# Altium schematic sheet PSU.SchDoc
size A
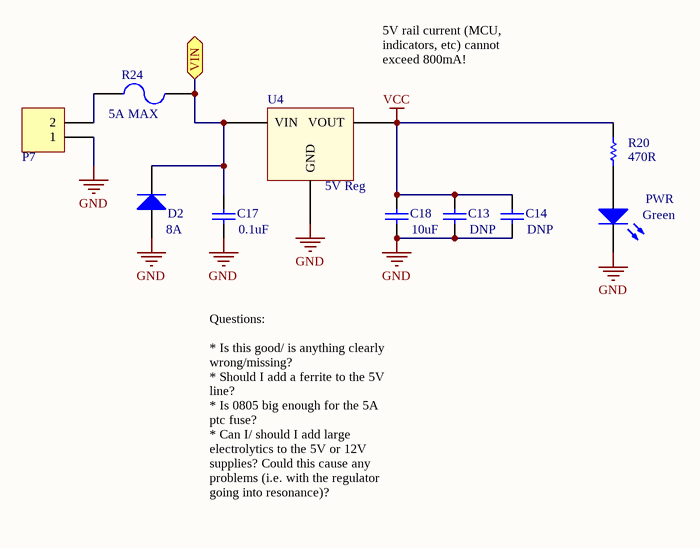
[diagram p0: PSU.SchDoc]

## Parts
C13  value DNP  [0805]  (hidden comment: Cap)
C14  value DNP  [0805]  (hidden comment: Cap)
C17  value 0.1uF  [0805]  (hidden comment: Cap)
C18  value 10uF  [0805]  (hidden comment: Cap)
D2  Max Current: 8A  [S8MC Diode]  (hidden comment: Diode S8MC)
P7  Screw Terminal  [Screw Terminal]  (value not drawn)
PWR  Color: Green  [0805]  (hidden comment: LED0)
R20  value 470R  [6-0805_N]  (hidden comment: Res1)
R24  Itrip: 5A MAX  [0805]  (hidden comment: Chip PTC)
U4  5V Reg  [4-Pin SOT223]

## Ports
VIN

## Nets
GND: C13.1 C14.1 C17.1 C18.1 D2.1(A) P7.1 PWR.2(K) U4.1(GND)
VCC: C13.2 C14.2 C18.2 R20.2 U4.2(VOUT)
VIN: C17.2 D2.2(C) R24.2 U4.3(VIN) ; port VIN
NetP7_2: P7.2 R24.1
NetPWR_1: PWR.1(A) R20.1

## Notes on the sheet
- (near U4) 5V rail current (MCU, indicators, etc) cannot exceed 800mA!
- Questions:
  * Is this good/ is anything clearly wrong/missing?
  * Should I add a ferrite to the 5V line?
  * Is 0805 big enough for the 5A ptc fuse?
  * Can I/ should I add large electrolytics to the 5V or 12V supplies? Could this cause any
  problems (i.e. with the regulator going into resonance)?

## Library data of the parts
C13 C14 C17 C18 = Cap: Capacitor; Published: 8-Jun-2000; LatestRevisionDate: 17-Jul-2002; LatestRevisionNote: Re-released for DXP Platform.; PackageReference: RAD-0.3; Publisher: Altium Limited; PackageDescription: Radial Cap, Thru-Hole; 2 Leads; 0.3 in Pin Spacing
D2 = Diode S8MC: Standard Diode; Manufacturer Part No.: S8MC-13; Max Voltage: 1kV; Digi-Key Part No.: S8MCDICT-ND
P7 = Screw Terminal: Manufacturer Part No.: 1935161; Digi-Key Part No.: 277-1667-ND
PWR = LED0: Typical INFRARED GaAs LED; Published: 8-Jun-2000; LatestRevisionDate: 08-Jul-2005; LatestRevisionNote: Mech Layer 1 removed.; PackageReference: LED-0; Publisher: Altium Limited; PackageDescription: LED; 2 Leads
R20 = Res1: Resistor; Published: 8-Jun-2000; LatestRevisionDate: 17-Jul-2002; LatestRevisionNote: Re-released for DXP Platform.; PackageReference: AXIAL-0.3; Publisher: Altium Limited; PackageDescription: Axial Device, Thru-Hole; 2 Leads; 0.3 in Pin Spacing
R24 = PTC
U4 = 5V Linear Regulator: Manufacturer Part No.: LD1117S50CTR; Output Current: 800mA; Digi-Key Part No.: 497-1243-1-ND